# EAGLE schematic Clippard 8-MC_v01 (EAGLE 9.7.0)
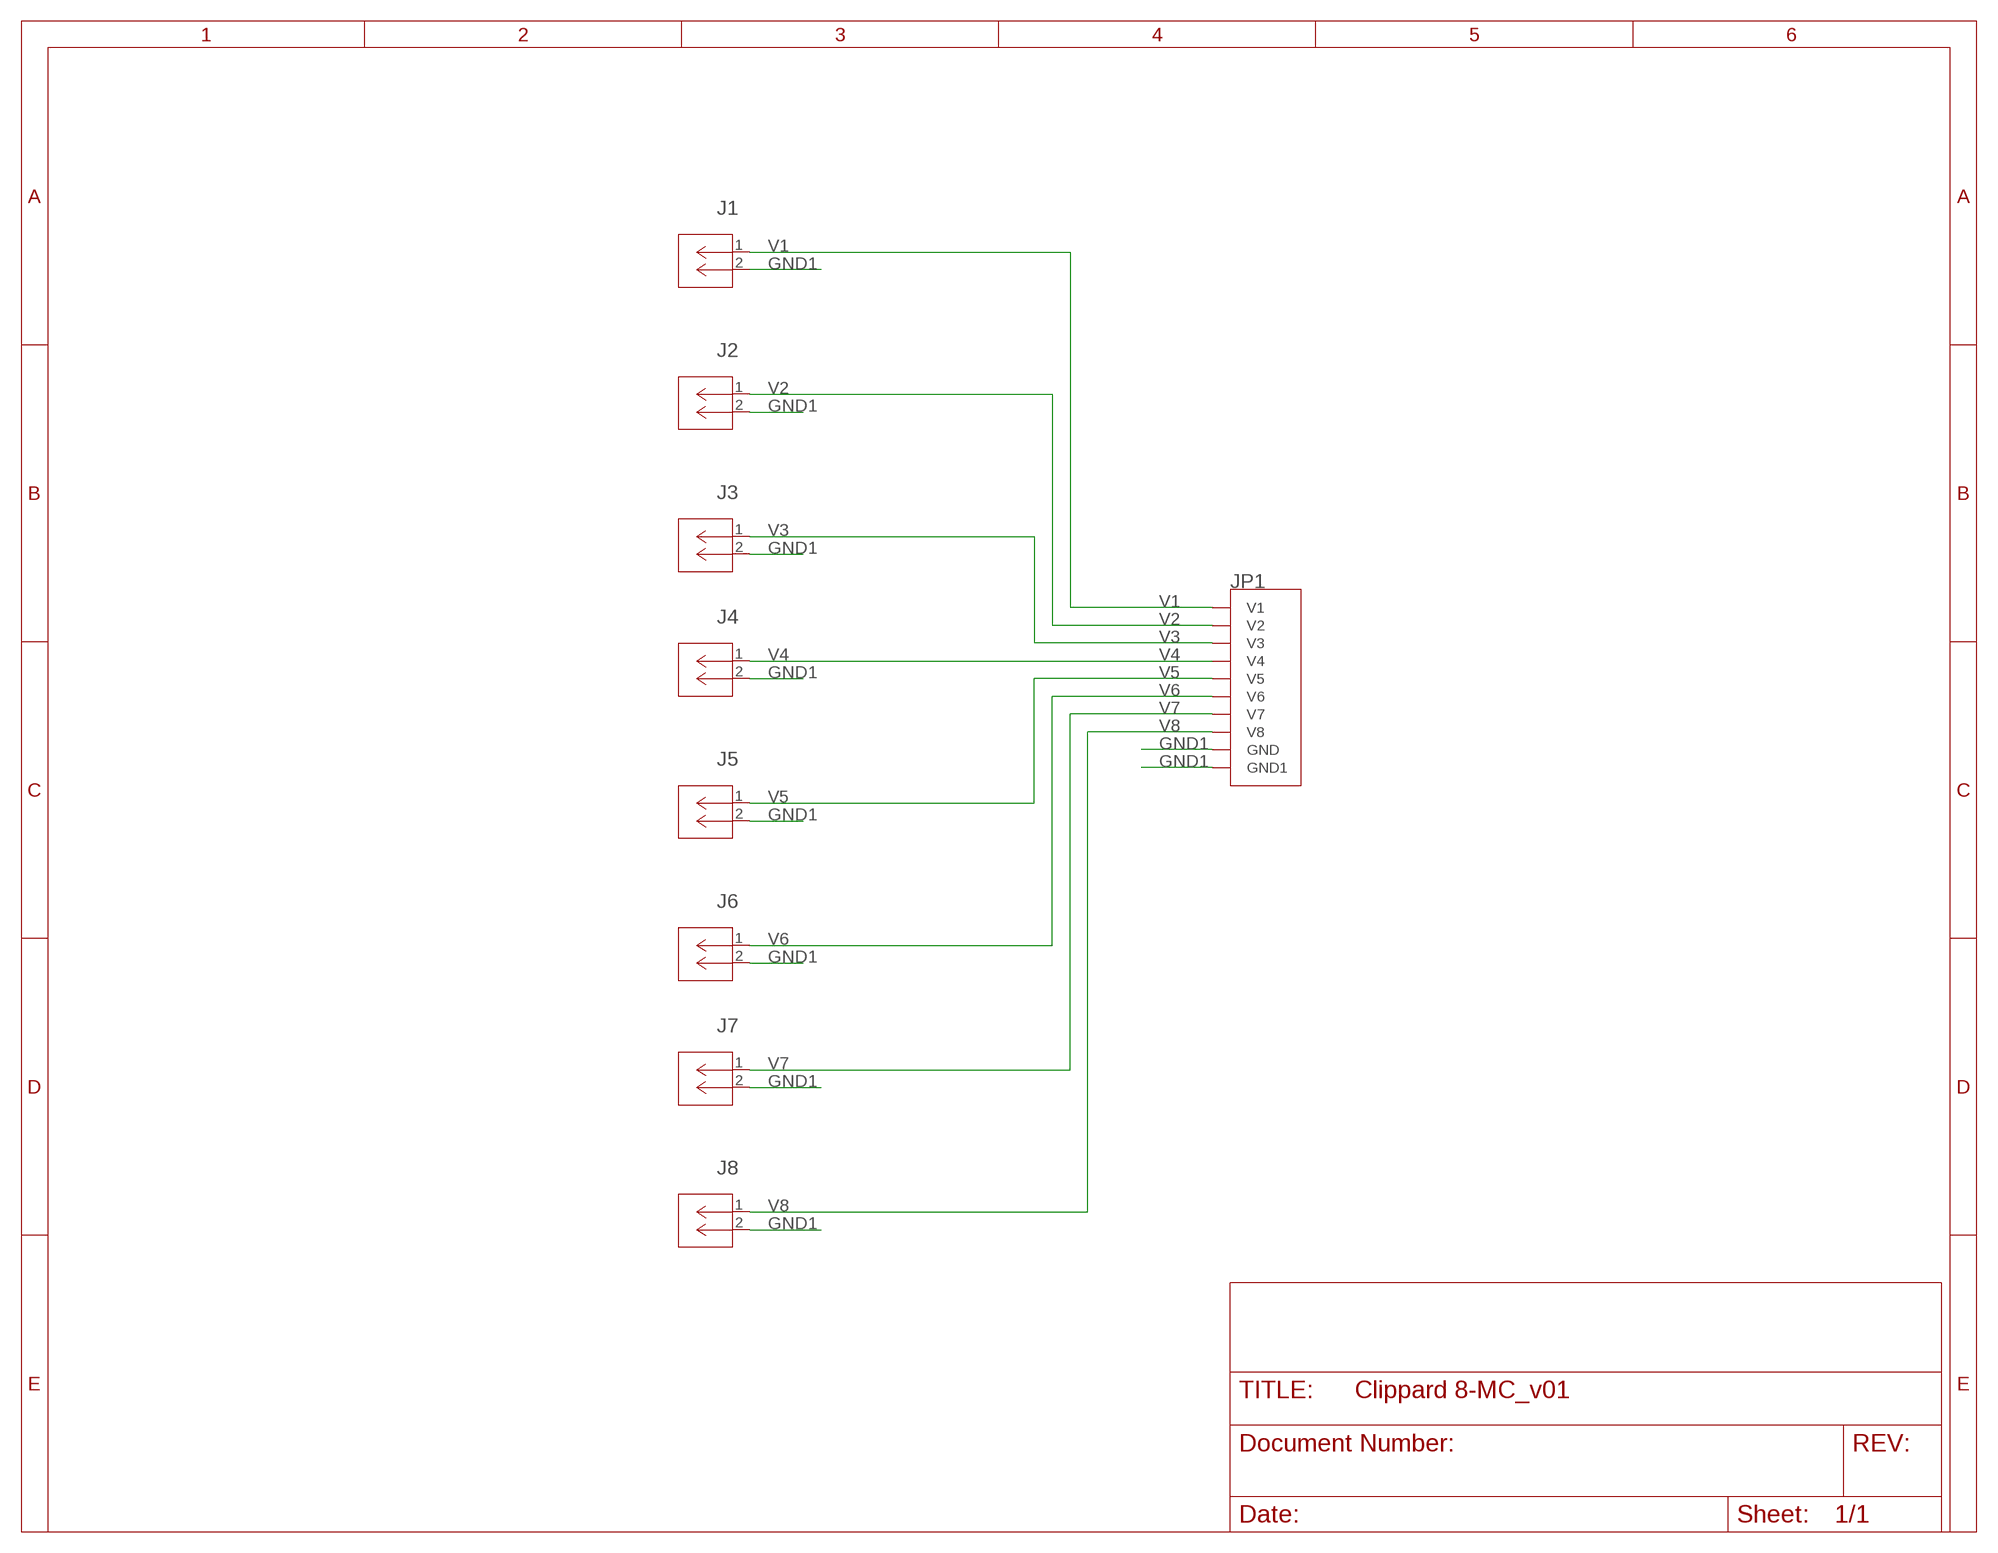
[diagram p0: schematic, sheet 1]

## Parts
J1  MOLEX_436500215C  [MOLEX_2P_FOOTPRINT_CENTERED]
J2  MOLEX_436500215C  [MOLEX_2P_FOOTPRINT_CENTERED]
J3  MOLEX_436500215C  [MOLEX_2P_FOOTPRINT_CENTERED]
J4  MOLEX_436500215C  [MOLEX_2P_FOOTPRINT_CENTERED]
J5  MOLEX_436500215C  [MOLEX_2P_FOOTPRINT_CENTERED]
J6  MOLEX_436500215C  [MOLEX_2P_FOOTPRINT_CENTERED]
J7  MOLEX_436500215C  [MOLEX_2P_FOOTPRINT_CENTERED]
J8  MOLEX_436500215C  [MOLEX_2P_FOOTPRINT_CENTERED]
JP1  CONN_10P_TE_1761681-3C  [CONN_10P_TE_1761681-3_SE_FOR_V02_CENTERED]

## Nets
GND1: J1.2 J2.2 J3.2 J4.2 J5.2 J6.2 J7.2 J8.2 JP1.GND JP1.GND.(GND1)
V1: J1.1 JP1.V1
V2: J2.1 JP1.V2
V3: J3.1 JP1.V3
V4: J4.1 JP1.V4
V5: J5.1 JP1.V5
V6: J6.1 JP1.V6
V7: J7.1 JP1.V7
V8: J8.1 JP1.V8

## Library data of the parts
J1-J8 = lib_v3:MOLEX_436500215: Connector Header Through Hole 2 position 0.118" (3.00mm)
JP1 = lib_v3:CONN_10P_TE_1761681-3: Connector Header Through Hole 10 position 0.100" (2.54mm)